# Altium schematic sheet USBtoRS232.SchDoc
size A4
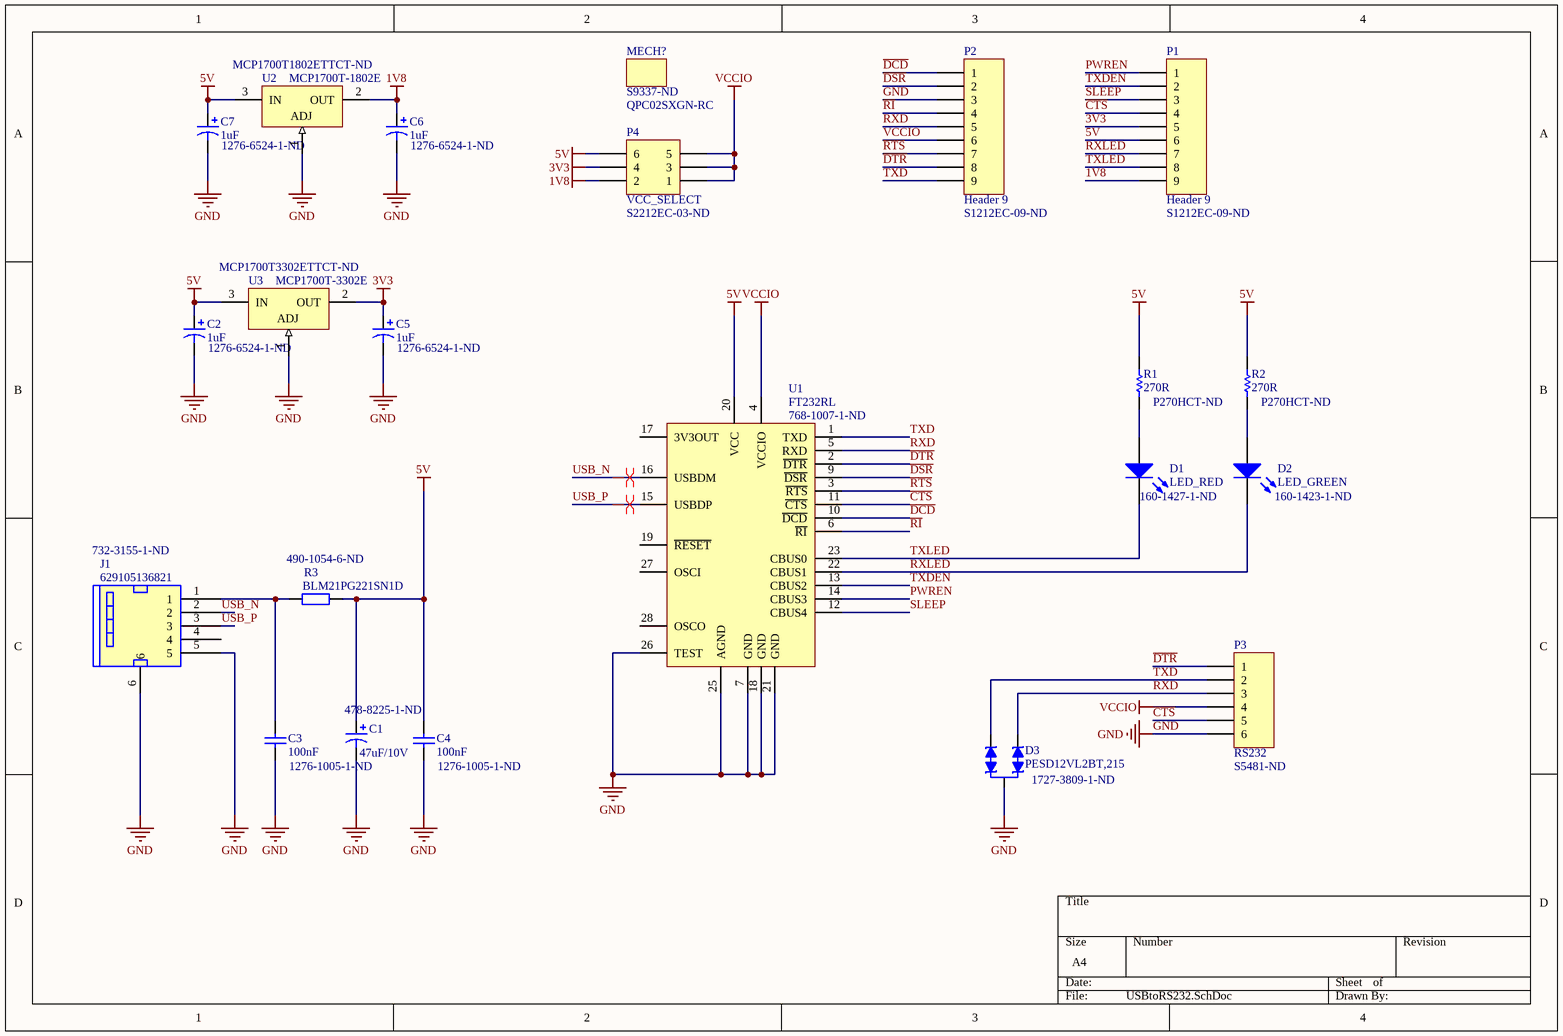
[diagram p0: USBtoRS232.SchDoc]

## Parts
C1  47uF/10V  Supplier Part Number 1: 478-8225-1-ND  [TANT_C1206(3216)]
C2  1uF  Supplier Part Number 1: 1276-6524-1-ND  [CAPC1608X09N]
C3  100nF  Supplier Part Number 1: 1276-1005-1-ND  [CAPC1608X09N]
C4  100nF  Supplier Part Number 1: 1276-1005-1-ND  [CAPC1608X09N]
C5  1uF  Supplier Part Number 1: 1276-6524-1-ND  [CAPC1608X09N]
C6  1uF  Supplier Part Number 1: 1276-6524-1-ND  [CAPC1608X09N]
C7  1uF  Supplier Part Number 1: 1276-6524-1-ND  [CAPC1608X09N]
D1  LED_RED  Supplier Part Number 1: 160-1427-1-ND  [L0805_RED]
D2  LED_GREEN  Supplier Part Number 1: 160-1423-1-ND  [L0805_GRE]
D3  PESD12VL2BT,215  Supplier Part Number 1: 1727-3809-1-ND  [SOT23-A]
J1  629105136821  Supplier Part Number 1: 732-3155-1-ND  [MICRO_USB]
MECH?  QPC02SXGN-RC  Supplier Part Number 1: S9337-ND
P1  Header 9  Supplier Part Number 1: S1212EC-09-ND  [Pin Header S/M 09x1 TH Pitch 2.54mm]
P2  Header 9  Supplier Part Number 1: S1212EC-09-ND  [Pin Header S/M 09x1 TH Pitch 2.54mm]
P3  RS232  Supplier Part Number 1: S5481-ND  [Pin Header RA/F 06x1 TH Pitch 2.54mm]
P4  VCC_SELECT  Supplier Part Number 1: S2212EC-03-ND  [Pin Header S/M 03x2 TH Pitch 2.54mm]
R1  270R  Supplier Part Number 1: P270HCT-ND  [RES1608X06N]
R2  270R  Supplier Part Number 1: P270HCT-ND  [RES1608X06N]
R3  BLM21PG221SN1D  Supplier Part Number 1: 490-1054-6-ND  [F0805(2012)]
U1  FT232RL  Supplier Part Number 1: 768-1007-1-ND  [SSOP-28]
U2  MCP1700T-1802E  Supplier Part Number 1: MCP1700T1802ETTCT-ND  [SOT23-A]
U3  MCP1700T-3302E  Supplier Part Number 1: MCP1700T3302ETTCT-ND  [SOT23-A]

## Nets
1V8: C6.1 P1.9 P4.2 U2.2(OUT)
3V3: C5.1 P1.5 P4.4 U3.2(OUT)
5V: C1.1 C2.1 C4.2 C7.1 P1.6 P4.6 R1.2 R2.2 R3.2 U1.20(VCC) U2.3(IN) U3.3(IN)
GND: C1.2 C2.2 C3.1 C4.1 C5.2 C6.2 C7.2 D3.3 J1.5 J1.6 P2.3 P3.6 U1.7(GND) U1.18(GND) U1.21(GND) U1.25(AGND) U1.26(TEST) U2.1(ADJ) U3.1(ADJ)
NC: U1.8(NC) U1.24(NC)
VCCIO: P2.6 P3.4 P4.1 P4.3 P4.5 U1.4(VCCIO)
~{CTS}: P1.4 P3.5 U1.11(~{CTS})
~{DCD}: P2.1 U1.10(~{DCD})
~{DSR}: P2.2 U1.9(~{DSR})
~{DTR}: P2.8 P3.1 U1.2(~{DTR})
PWREN: P1.1 U1.14(CBUS3)
~{RI}: P2.4 U1.6(~{RI})
~{RTS}: P2.7 U1.3(~{RTS})
RXD: D3.1 P2.5 P3.3 U1.5(RXD)
RXLED: D2.2(K) P1.7 U1.22(CBUS1)
SLEEP: P1.3 U1.12(CBUS4)
TXD: D3.2 P2.9 P3.2 U1.1(TXD)
TXDEN: P1.2 U1.13(CBUS2)
TXLED: D1.2(K) P1.8 U1.23(CBUS0)
USB_N: J1.2 U1.16(USBDM)
USB_P: J1.3 U1.15(USBDP)
NetC3_2: C3.2 J1.1 R3.1
NetD1_1: D1.1(A) R1.1
NetD2_1: D2.1(A) R2.1

Not connected (* = marked no-connect by the designer): J1 4; U1 17(3V3OUT) 19(~{RESET}) 27(OSCI) 28(OSCO)

## Layout directives
differential pair: USB_N, USB_P

## Library data of the parts
C1 = Cap Pol1: CAP TANT 47UF 20% 10V 1206; Manufacturer 1: AVX; Manufacturer Part Number 1: F931A476MAA; Supplier 1: Digi-Key; Stock 1: 29684; Pricing 1: 1=0,76000, 10=0,55900, 100=0,38340, 500=0,30350, 1000=0,25558 (USD); ComponentLink1URL: http://www.mouser.com/ds/2/40/f93-776559.pdf?src-supplier=Mouser; ComponentLink1Description: http://www.mouser.com/ds/2/40/f93-776559.pdf?src-supplier=Mouser; ComponentLink2URL: http://datasheets.avx.com/F93.pdf?src-supplier=Digi-Key; ComponentLink2Description: http://datasheets.avx.com/F93.pdf?src-supplier=Digi-Key; ComponentLink3URL: http://datasheet.octopart.com/F931A476MAA-AVX-datasheet-50868108.pdf?src-supplier=AVX; ComponentLink3Description: http://datasheet.octopart.com/F931A476MAA-AVX-datasheet-50868108.pdf?src-supplier=AVX; ComponentLink4URL: http://datasheet.octopart.com/F931A476MAA-AVX-datasheet-103254539.pdf?src-supplier=Newark; ComponentLink4Description: http://datasheet.octopart.com/F931A476MAA-AVX-datasheet-103254539.pdf?src-supplier=Newark
C2 C5-C7 = Cap Pol3: Ceramic Capacitor (Surface Mount); Manufacturer 1: Samsung; Manufacturer Part Number 1: CL10B105MO8NNWC; Voltage Rating: 16V; Tolerance: 20%; Supplier 1: Digi-Key; Stock 1: 10167463; Pricing 1: 1=0,10000, 10=0,04200, 100=0,01860, 500=0,01330, 1000=0,01045 (USD); Mount: Surface Mount; Case/Package: 0603; Case Code (Metric): 1608; Case Code (Imperial): 0603; Min Operating Temperature: -55°C; Max Operating Temperature: 125°C; Packaging: Tape and Reel; Capacitance: 1uF; Length: 0.063inch; Width: 0.031inch; Thickness: 0.035inch; ComponentLink1URL: http://www.samsungsem.com/kr/support/product-search/mlcc/CL10B105MO8NNWC.jsp?src-supplier=Digi-Key; ComponentLink1Description: http://www.samsungsem.com/kr/support/product-search/mlcc/CL10B105MO8NNWC.jsp?src-supplier=Digi-Key; ComponentLink2URL: http://datasheet.octopart.com/CL10B105MO8NNWC-Samsung-Electro-Mechanics-datasheet-68297032.pdf?src-supplier=Future+Electronics; ComponentLink2Description: http://datasheet.octopart.com/CL10B105MO8NNWC-Samsung-Electro-Mechanics-datasheet-68297032.pdf?src-supplier=Future+Electronics; ComponentLink3URL: http://datasheet.octopart.com/CL10B105MO8NNWC-Samsung-Electro-Mechanics-datasheet-96443611.pdf?src-supplier=Future+Electronics; ComponentLink3Description: http://datasheet.octopart.com/CL10B105MO8NNWC-Samsung-Electro-Mechanics-datasheet-96443611.pdf?src-supplier=Future+Electronics; ComponentLink4URL: http://datasheet.octopart.com/CL10B105MO8NNWC-Samsung-Electro-Mechanics-datasheet-120079234.pdf?src-supplier=Future+Electronics; ComponentLink4Description: http://datasheet.octopart.com/CL10B105MO8NNWC-Samsung-Electro-Mechanics-datasheet-120079234.pdf?src-supplier=Future+Electronics
C3 C4 = Cap: Ceramic Capacitor (Surface Mount); Manufacturer 1: Samsung; Manufacturer Part Number 1: CL10B104KO8NNNC; Tolerance: 10%; Voltage Rating: 16V; Dielectric: X7R; Supplier 1: Digi-Key; Stock 1: 12803497; Pricing 1: 1=0,10000, 10=0,02900, 100=0,01300, 500=0,00928, 1000=0,00729 (USD); Mount: Surface Mount; Case/Package: 0603; Case Code (Metric): 1608; Case Code (Imperial): 0603; Material: Ceramic; Contact Plating: Tin; Min Operating Temperature: -55°C; Max Operating Temperature: 125°C; Packaging: Tape and Reel; Capacitance: 100nF; Package Quantity: 1; Voltage: 16V; Voltage Rating (DC): 16V; Length: 1.6mm; Height: 0.8mm; Width: 0.031inch; Thickness: 0.035inch; Depth: 0.8mm; Radiation Hardening: No; Lead Free: Lead Free; ComponentLink1URL: https://datasheet.ciiva.com/26838/getdatasheetpartid-357417-26838418.pdf?src-supplier=Verical; ComponentLink1Description: https://datasheet.ciiva.com/26838/getdatasheetpartid-357417-26838418.pdf?src-supplier=Verical; ComponentLink2URL: https://datasheet.ciiva.com/25805/cl10b104ko8nnnc-25805483.pdf?src-supplier=Digi-Key; ComponentLink2Description: https://datasheet.ciiva.com/25805/cl10b104ko8nnnc-25805483.pdf?src-supplier=Digi-Key; ComponentLink3URL: https://datasheet.ciiva.com/29198/456679-da-01-en-vs-kondensator-0603-29198846.pdf?src-supplier=Conrad; ComponentLink3Description: https://datasheet.ciiva.com/29198/456679-da-01-en-vs-kondensator-0603-29198846.pdf?src-supplier=Conrad; ComponentLink4URL: http://datasheet.octopart.com/CL10B104KO8NNNC-Samsung-Electro-Mechanics-datasheet-8324245.pdf; ComponentLink4Description: http://datasheet.octopart.com/CL10B104KO8NNNC-Samsung-Electro-Mechanics-datasheet-8324245.pdf; ComponentLink5URL: http://datasheet.octopart.com/CL10B104KO8NNNC-Samsung-Electro-Mechanics-datasheet-11890603.pdf?src-supplier=Arrow; ComponentLink5Description: http://datasheet.octopart.com/CL10B104KO8NNNC-Samsung-Electro-Mechanics-datasheet-11890603.pdf?src-supplier=Arrow; ComponentLink6URL: http://datasheet.octopart.com/CL10B104KO8NNNC-Samsung-Electro-Mechanics-datasheet-81461844.pdf?src-supplier=Future+Electronics; ComponentLink6Description: http://datasheet.octopart.com/CL10B104KO8NNNC-Samsung-Electro-Mechanics-datasheet-81461844.pdf?src-supplier=Future+Electronics; ComponentLink7URL: http://datasheet.octopart.com/CL10B104KO8NNNC-Samsung-Electro-Mechanics-datasheet-116890973.pdf?src-supplier=Future+Electronics; ComponentLink7Description: http://datasheet.octopart.com/CL10B104KO8NNNC-Samsung-Electro-Mechanics-datasheet-116890973.pdf?src-supplier=Future+Electronics; ComponentLink8URL: http://datasheet.octopart.com/CL10B104KO8NNNC-Samsung-Electro-Mechanics-datasheet-136482305.pdf?src-supplier=Future+Electronics; ComponentLink8Description: http://datasheet.octopart.com/CL10B104KO8NNNC-Samsung-Electro-Mechanics-datasheet-136482305.pdf?src-supplier=Future+Electronics; ComponentLink9URL: http://datasheet.octopart.com/CL10B104KO8NNNC-Samsung-datasheet-8326407.pdf?src-supplier=TME; ComponentLink9Description: http://datasheet.octopart.com/CL10B104KO8NNNC-Samsung-datasheet-8326407.pdf?src-supplier=TME; ComponentLink10URL: http://datasheet.octopart.com/CL10B104KO8NNNC-Samsung-datasheet-26589157.pdf?src-supplier=Future+Electronics; ComponentLink10Description: http://datasheet.octopart.com/CL10B104KO8NNNC-Samsung-datasheet-26589157.pdf?src-supplier=Future+Electronics; ComponentLink11URL: http://datasheet.octopart.com/CL10B104KO8NNNC-Samsung-datasheet-42770384.pdf?src-supplier=Future+Electronics; ComponentLink11Description: http://datasheet.octopart.com/CL10B104KO8NNNC-Samsung-datasheet-42770384.pdf?src-supplier=Future+Electronics; ComponentLink12URL: http://datasheet.octopart.com/General-Multilayer-Ceramic-Capacitors-Samsung-datasheet-family-111.pdf; ComponentLink12Description: http://datasheet.octopart.com/General-Multilayer-Ceramic-Capacitors-Samsung-datasheet-family-111.pdf
D1 = LED0: LED RED CLEAR SMD; Manufacturer 1: Lite-On; Manufacturer Part Number 1: LTST-C171KRKT; Lens Color: Colorless; Viewing Angle: 130°; Lens Style: Diffused; Forward Current: 30mA; Forward Voltage: 2V; Power Rating: 75mW; Luminous Intensity: 54mcd; Test Current: 20mA; Dominant Wavelength: 631nm; Number of Elements: 1; Wavelength: 639nm; Reverse Voltage: 5V; Supplier 1: Digi-Key; Stock 1: 96925; Pricing 1: 1=0,29000, 10=0,21500, 100=0,10160, 500=0,06774, 1000=0,05306 (USD); Mount: Surface Mount; Case/Package: 0805; Number of Pins: 2; Color: Red; Case Code (Metric): 2012; Case Code (Imperial): 0805; Min Operating Temperature: -55°C; Max Operating Temperature: 85°C; Package Quantity: 3000; Packaging: Tape and Reel; Illumination Color: Red; Lens Transparency: Clear; Power Dissipation: 75mW; Number of LEDs: 1; Length: 2mm; Height: 0.8mm; Width: 1.25mm; Depth: 1.25mm; Radiation Hardening: No; Lead Free: Lead Free; ComponentLink1URL: https://datasheet.ciiva.com/12403/lite-on-ltst-c171krkt-187201-12403781.pdf?src-supplier=Mouser; ComponentLink1Description: https://datasheet.ciiva.com/12403/lite-on-ltst-c171krkt-187201-12403781.pdf?src-supplier=Mouser; ComponentLink2URL: https://datasheet.ciiva.com/11775/0900766b80dc0299-11775643.pdf?src-supplier=RSComponents; ComponentLink2Description: https://datasheet.ciiva.com/11775/0900766b80dc0299-11775643.pdf?src-supplier=RSComponents; ComponentLink3URL: https://datasheet.ciiva.com/16444/lite-on20ltst-c171krkt-16444779.pdf?src-supplier=Future+Electronics; ComponentLink3Description: https://datasheet.ciiva.com/16444/lite-on20ltst-c171krkt-16444779.pdf?src-supplier=Future+Electronics; ComponentLink4URL: https://datasheet.ciiva.com/2110/s-110-ltst-c171krkt-2110066.pdf?src-supplier=Digi-Key; ComponentLink4Description: https://datasheet.ciiva.com/2110/s-110-ltst-c171krkt-2110066.pdf?src-supplier=Digi-Key; ComponentLink5URL: https://datasheet.ciiva.com/2110/s-110-ltst-c171krkt-2110067.pdf?src-supplier=Digi-Key; ComponentLink5Description: https://datasheet.ciiva.com/2110/s-110-ltst-c171krkt-2110067.pdf?src-supplier=Digi-Key; ComponentLink6URL: https://datasheet.ciiva.com/2110/s-110-ltst-c171krkt-2110068.pdf?src-supplier=Digi-Key; ComponentLink6Description: https://datasheet.ciiva.com/2110/s-110-ltst-c171krkt-2110068.pdf?src-supplier=Digi-Key; ComponentLink7URL: http://datasheet.octopart.com/LTST-C171KRKT-Lite-On-datasheet-166436.pdf?src-supplier=_legacy+Avnet; ComponentLink7Description: http://datasheet.octopart.com/LTST-C171KRKT-Lite-On-datasheet-166436.pdf?src-supplier=_legacy+Avnet; ComponentLink8URL: http://datasheet.octopart.com/LTST-C171KRKT-Lite-On-datasheet-32046998.pdf?src-supplier=TME; ComponentLink8Description: http://datasheet.octopart.com/LTST-C171KRKT-Lite-On-datasheet-32046998.pdf?src-supplier=TME; ComponentLink9URL: http://datasheet.octopart.com/LTST-C171KRKT-Lite-On-datasheet-62737.pdf?src-supplier=Digi-Key; ComponentLink9Description: http://datasheet.octopart.com/LTST-C171KRKT-Lite-On-datasheet-62737.pdf?src-supplier=Digi-Key; ComponentLink10URL: http://datasheet.octopart.com/LTST-C171KRKT-Lite-On-datasheet-8330373.pdf?src-supplier=Future+Electronics; ComponentLink10Description: http://datasheet.octopart.com/LTST-C171KRKT-Lite-On-datasheet-8330373.pdf?src-supplier=Future+Electronics
D2 = LED0: LED GREEN CLEAR CHIP SMD; Manufacturer 1: Lite-On; Manufacturer Part Number 1: LTST-C171GKT; Lens Color: Colorless; Viewing Angle: 130°; Lens Style: Diffused; Luminous Intensity: 12mcd; Forward Current: 30mA; Forward Voltage: 2.1V; Power Rating: 100mW; Dominant Wavelength: 569nm; Test Current: 10mA; Number of Elements: 1; Wavelength: 585nm; Reverse Voltage: 5V; Supplier 1: Digi-Key; Stock 1: 194100; Pricing 1: 1=0,28000, 10=0,20100, 100=0,09540, 500=0,06364, 1000=0,04984 (USD); Mount: Surface Mount; Case/Package: 0805; Number of Pins: 2; Color: Green; Case Code (Metric): 2012; Case Code (Imperial): 0805; Min Operating Temperature: -55°C; Max Operating Temperature: 85°C; Package Quantity: 1; Packaging: Tape and Reel; Illumination Color: Green; Lens Transparency: Clear; Power Dissipation: 100mW; Number of LEDs: 1; Length: 2mm; Height: 0.8mm; Width: 1.25mm; Depth: 1.25mm; Radiation Hardening: No; Lead Free: Lead Free; ComponentLink1URL: https://datasheet.ciiva.com/11773/0900766b80dc0296-11773991.pdf?src-supplier=RSComponents; ComponentLink1Description: https://datasheet.ciiva.com/11773/0900766b80dc0296-11773991.pdf?src-supplier=RSComponents; ComponentLink2URL: https://datasheet.ciiva.com/2110/ltst-c171gkt-2110000.pdf?src-supplier=Digi-Key; ComponentLink2Description: https://datasheet.ciiva.com/2110/ltst-c171gkt-2110000.pdf?src-supplier=Digi-Key; ComponentLink3URL: https://datasheet.ciiva.com/12400/lite-on-ltst-c171gkt-190133-12400647.pdf?src-supplier=Mouser; ComponentLink3Description: https://datasheet.ciiva.com/12400/lite-on-ltst-c171gkt-190133-12400647.pdf?src-supplier=Mouser; ComponentLink4URL: https://datasheet.ciiva.com/2110/ltst-c171gkt-2110001.pdf?src-supplier=Digi-Key; ComponentLink4Description: https://datasheet.ciiva.com/2110/ltst-c171gkt-2110001.pdf?src-supplier=Digi-Key; ComponentLink5URL: https://datasheet.ciiva.com/2110/ltst-c171gkt-2110002.pdf?src-supplier=Digi-Key; ComponentLink5Description: https://datasheet.ciiva.com/2110/ltst-c171gkt-2110002.pdf?src-supplier=Digi-Key; ComponentLink6URL: https://datasheet.ciiva.com/16396/ltst-c171gkt-16396549.pdf?src-supplier=Future+Electronics; ComponentLink6Description: https://datasheet.ciiva.com/16396/ltst-c171gkt-16396549.pdf?src-supplier=Future+Electronics; ComponentLink7URL: http://datasheet.octopart.com/LTST-C171GKT-Lite-On-datasheet-95087.pdf?src-supplier=Future+Electronics; ComponentLink7Description: http://datasheet.octopart.com/LTST-C171GKT-Lite-On-datasheet-95087.pdf?src-supplier=Future+Electronics; ComponentLink8URL: http://datasheet.octopart.com/LTST-C171GKT-Lite-On-datasheet-158474.pdf?src-supplier=Arrow; ComponentLink8Description: http://datasheet.octopart.com/LTST-C171GKT-Lite-On-datasheet-158474.pdf?src-supplier=Arrow; ComponentLink9URL: http://datasheet.octopart.com/LTST-C171GKT-Lite-On-datasheet-7823512.pdf?src-supplier=Jameco; ComponentLink9Description: http://datasheet.octopart.com/LTST-C171GKT-Lite-On-datasheet-7823512.pdf?src-supplier=Jameco; ComponentLink10URL: http://datasheet.octopart.com/LTST-C171GKT-Lite-On-datasheet-62340966.pdf?src-supplier=TME; ComponentLink10Description: http://datasheet.octopart.com/LTST-C171GKT-Lite-On-datasheet-62340966.pdf?src-supplier=TME
D3 = PESD12VL2BT: TVS DIODE 12V 37V SOT23; Manufacturer 1: Nexperia; ComponentLink1URL: \\vikoonline\TPM-ARGE\AR-GE\DATA SHEET\; Supplier 1: Digi-Key; Manufacturer Part Number 1: PESD12VL2BT,215; Stock 1: 67274; Pricing 1: 1=0,48000, 10=0,38700, 100=0,26370, 500=0,19776, 1000=0,14832 (USD); ComponentLink2URL: http://www.farnell.com/datasheets/698115.pdf?src-supplier=Farnell; ComponentLink2Description: http://www.farnell.com/datasheets/698115.pdf?src-supplier=Farnell; ComponentLink3URL: https://assets.nexperia.com/documents/data-sheet/PESDXL2BT_SER.pdf?src-supplier=Digi-Key; ComponentLink3Description: https://assets.nexperia.com/documents/data-sheet/PESDXL2BT_SER.pdf?src-supplier=Digi-Key; ComponentLink4URL: http://www.farnell.com/datasheets/698115.pdf?src-supplier=Newark; ComponentLink4Description: http://www.farnell.com/datasheets/698115.pdf?src-supplier=Newark; ComponentLink5URL: http://datasheet.octopart.com/PESD12VL2BT%2C215-Nexperia-datasheet-78830454.pdf?src-supplier=Nexperia; ComponentLink5Description: http://datasheet.octopart.com/PESD12VL2BT%2C215-Nexperia-datasheet-78830454.pdf?src-supplier=Nexperia; ComponentLink6URL: http://datasheet.octopart.com/PESD12VL2BT%2C215-Nexperia-datasheet-10228526.pdf?src-supplier=Newark; ComponentLink6Description: http://datasheet.octopart.com/PESD12VL2BT%2C215-Nexperia-datasheet-10228526.pdf?src-supplier=Newark
J1 = MINI_USB: CONN RCPT USB2.0 MICRO B SMD R/A; Manufacturer 1: Würth Elektronik; Plating: Nickel; Current Rating: 1.8A; Gender: Receptacle; Voltage Rating: 30V; Connector Type: USB; Number of Contacts: 5; Insulation Resistance: 1GR; Number of Ports: 1; Supplier 1: Digi-Key; Manufacturer Part Number 1: 629105136821; Stock 1: 3452; Pricing 1: 1=1,29000, 10=1,27500, 50=1,18440, 100=1,09250, 500=1,00152 (USD); Mount: Surface Mount; Contact Plating: Gold; Contact Material: Copper Alloy; Color: Black; Min Operating Temperature: -40°C; Max Operating Temperature: 105°C; Package Quantity: 1400; Packaging: Tape and Reel; Number of Positions: 5; Termination: Solder; Orientation: Right Angle; USB Standard: USB 2.0; Length: 5.9mm; REACH SVHC: Unknown; Lead Free: Lead Free; Flammability Rating: UL94 V-0; ComponentLink1URL: https://datasheet.ciiva.com/851/629105136821-851196.pdf?src-supplier=Digi-Key; ComponentLink1Description: https://datasheet.ciiva.com/851/629105136821-851196.pdf?src-supplier=Digi-Key; ComponentLink2URL: https://datasheet.ciiva.com/12494/629105136821-221118-12494781.pdf?src-supplier=Mouser; ComponentLink2Description: https://datasheet.ciiva.com/12494/629105136821-221118-12494781.pdf?src-supplier=Mouser; ComponentLink3URL: https://datasheet.ciiva.com/851/629105136821-851197.pdf?src-supplier=Digi-Key; ComponentLink3Description: https://datasheet.ciiva.com/851/629105136821-851197.pdf?src-supplier=Digi-Key; ComponentLink4URL: https://datasheet.ciiva.com/851/629105136821-851198.pdf?src-supplier=Digi-Key; ComponentLink4Description: https://datasheet.ciiva.com/851/629105136821-851198.pdf?src-supplier=Digi-Key; ComponentLink5URL: http://datasheet.octopart.com/629105136821-W%C3%BCrth-Elektronik-datasheet-111088069.pdf?src-supplier=W%c3%bcrth+Elektronik; ComponentLink5Description: http://datasheet.octopart.com/629105136821-W%C3%BCrth-Elektronik-datasheet-111088069.pdf?src-supplier=W%c3%bcrth+Elektronik; ComponentLink6URL: http://datasheet.octopart.com/629105136821-W%C3%BCrth-Elektronik-datasheet-31669337.pdf?src-supplier=Future+Electronics; ComponentLink6Description: http://datasheet.octopart.com/629105136821-W%C3%BCrth-Elektronik-datasheet-31669337.pdf?src-supplier=Future+Electronics
MECH? = MECHANIC: CONN JUMPER SHORTING .100" GOLD; Manufacturer 1: Sullins; Number of Positions: 2; Pitch: 0.1inch; Supplier 1: Digi-Key; Manufacturer Part Number 1: QPC02SXGN-RC; Stock 1: 941348; Pricing 1: 1=0,10000, 10=0,05900, 25=0,04400, 50=0,03780, 100=0,03650, 250=0,03152, 500=0,03024, 1000=0,02646, 2500=0,02394 (USD); Case/Package: 100; Contact Plating: Gold; Package Quantity: 2000; Packaging: Bulk; Height: 0.235inch; Lead Free: Lead Free; ComponentLink1URL: https://datasheet.ciiva.com/767/284-sxgn-11510-767869.pdf?src-supplier=Digi-Key; ComponentLink1Description: https://datasheet.ciiva.com/767/284-sxgn-11510-767869.pdf?src-supplier=Digi-Key; ComponentLink2URL: http://datasheet.octopart.com/QPC02SXGN-RC-Sullins-datasheet-12521006.pdf?src-supplier=Future+Electronics; ComponentLink2Description: http://datasheet.octopart.com/QPC02SXGN-RC-Sullins-datasheet-12521006.pdf?src-supplier=Future+Electronics; ComponentLink3URL: http://datasheet.octopart.com/QPC02SXGN-RC-Sullins-datasheet-41399305.pdf?src-supplier=Future+Electronics; ComponentLink3Description: http://datasheet.octopart.com/QPC02SXGN-RC-Sullins-datasheet-41399305.pdf?src-supplier=Future+Electronics
P1 P2 = Header 9: CONN HEADER VERT 9POS 2.54MM; Manufacturer 1: Sullins; Manufacturer Part Number 1: PREC009SFAN-RC; Number of Positions: 9; Connector Type: Male Pin; Pitch: 0.1inch; Supplier 1: Digi-Key; Stock 1: 1652; Pricing 1: 1=0,24000, 10=0,22700, 25=0,19360, 50=0,16940, 100=0,15720, 250=0,13912, 500=0,13306 (USD); Mount: Through Hole; Color: Black; Contact Plating: Tin; Package Quantity: 1; Number of Rows: 1; Packaging: Bulk; Termination: Solder; Contact Mating Length: 0.318inch; ComponentLink1URL: https://datasheet.ciiva.com/740/xrxczzzsxxn-rc-st-11635-b-740956.pdf?src-supplier=Digi-Key; ComponentLink1Description: https://datasheet.ciiva.com/740/xrxczzzsxxn-rc-st-11635-b-740956.pdf?src-supplier=Digi-Key
P3 = Header 6H: CONN HDR 6POS 0.1 GOLD PCB R/A; Manufacturer 1: Sullins; Manufacturer Part Number 1: PPPC061LGBN-RC; Number of Positions: 6; Connector Type: Header; Pitch: 0.1inch; LatestRevisionDate: 17-Jul-2002; LatestRevisionNote: Re-released for DXP Platform.; Publisher: Altium Limited; Supplier 1: Digi-Key; Stock 1: 17616; Pricing 1: 1=0,66000, 10=0,58300, 100=0,50290, 500=0,41148, 1000=0,36576, 5000=0,33020 (USD); Mount: Through Hole; Color: Black; Contact Plating: Gold; Contact Material: Bronze; Housing Color: Black; Housing Material: Plastic; Package Quantity: 1000; Number of Rows: 1; Packaging: Bulk; Termination: Solder; Length: 15.7mm; Height: 2.4mm; Width: 8.5mm; Lead Free: Lead Free; ComponentLink1URL: https://media.digikey.com/pdf/Data%20Sheets/Sullins%20PDFs/Female_Headers.100_DS.pdf?src-supplier=Digi-Key; ComponentLink1Description: https://media.digikey.com/pdf/Data%20Sheets/Sullins%20PDFs/Female_Headers.100_DS.pdf?src-supplier=Digi-Key; ComponentLink2URL: http://www.sullinscorp.com/catalogs/78_Page80-81_HEADER_.100_2.54mm_FEMALE.pdf?src-supplier=Future+Electronics; ComponentLink2Description: http://www.sullinscorp.com/catalogs/78_Page80-81_HEADER_.100_2.54mm_FEMALE.pdf?src-supplier=Future+Electronics; ComponentLink3URL: http://datasheet.octopart.com/PPPC061LGBN-RC-Sullins-datasheet-11567.pdf?src-supplier=Digi-Key; ComponentLink3Description: http://datasheet.octopart.com/PPPC061LGBN-RC-Sullins-datasheet-11567.pdf?src-supplier=Digi-Key; ComponentLink4URL: http://datasheet.octopart.com/PPPC061LGBN-RC-Sullins-datasheet-12511165.pdf?src-supplier=Future+Electronics; ComponentLink4Description: http://datasheet.octopart.com/PPPC061LGBN-RC-Sullins-datasheet-12511165.pdf?src-supplier=Future+Electronics; ComponentLink5URL: http://datasheet.octopart.com/PPPC061LGBN-RC-Sullins-datasheet-41308905.pdf?src-supplier=Future+Electronics; ComponentLink5Description: http://datasheet.octopart.com/PPPC061LGBN-RC-Sullins-datasheet-41308905.pdf?src-supplier=Future+Electronics
P4 = Header 3X2A: CONN HEADER VERT 6POS 2.54MM; Manufacturer 1: Sullins; Manufacturer Part Number 1: PREC003DFAN-RC; Number of Positions: 6; Connector Type: Male Pin; Pitch: 0.1inch; Supplier 1: Digi-Key; Stock 1: 869; Pricing 1: 1=0,16000, 10=0,15100, 25=0,12920, 50=0,11280, 100=0,10480, 250=0,09272, 500=0,08870 (USD); RoHS: Yes; Mount: Through Hole; Color: Black; Contact Plating: Tin; Package Quantity: 1; Number of Rows: 2; Packaging: Bulk; Termination: Solder; Row Spacing: 0.1inch; Contact Mating Length: 0.318inch; ComponentLink1URL: https://datasheet.ciiva.com/741/xrxczzzdxxn-rc-11636-b-741002.pdf?src-supplier=Digi-Key; ComponentLink1Description: https://datasheet.ciiva.com/741/xrxczzzdxxn-rc-11636-b-741002.pdf?src-supplier=Digi-Key
R1 R2 = Res1: Resistor; Manufacturer 1: Panasonic; Manufacturer Part Number 1: ERJ-3EKF2700V; Power Rating: 100mW; Tolerance: 1%; Voltage Rating: 75V; Temperature Coefficient: 100ppm/°C; Supplier 1: Digi-Key; Stock 1: 340311; Pricing 1: 1=0,10000, 10=0,06500, 100=0,02640, 1000=0,01186, 2500=0,01029 (USD); Mount: Surface Mount; Case/Package: 0603; Number of Pins: 2; Case Code (Imperial): 0603; Case Code (Metric): 1608; Contact Plating: Tin; Min Operating Temperature: -55°C; Max Operating Temperature: 155°C; Resistance: 270R; Packaging: Tape and Reel; Package Quantity: 1; Composition: Thick Film; Number of Terminations: 2; Military Standard: Not; Termination: SMD/SMT; Max Power Dissipation: 100mW; Voltage Rating (DC): 75V; Features: Automotive AEC-Q200; Length: 1.6mm; Height: 0.022inch; Width: 0.8mm; Depth: 0.8mm; Radiation Hardening: No; REACH SVHC: No SVHC; Lead Free: Lead Free; ComponentLink1URL: https://datasheet.ciiva.com/5860/aoa0000ce2-5860661.pdf?src-supplier=Farnell; ComponentLink1Description: https://datasheet.ciiva.com/5860/aoa0000ce2-5860661.pdf?src-supplier=Farnell; ComponentLink2URL: https://datasheet.ciiva.com/9183/aoa0000ce2-9183606.pdf?src-supplier=Avnet; ComponentLink2Description: https://datasheet.ciiva.com/9183/aoa0000ce2-9183606.pdf?src-supplier=Avnet; ComponentLink3URL: https://datasheet.ciiva.com/16776/70260748-16776089.pdf?src-supplier=Allied+Electronics; ComponentLink3Description: https://datasheet.ciiva.com/16776/70260748-16776089.pdf?src-supplier=Allied+Electronics; ComponentLink4URL: https://datasheet.ciiva.com/17206/aoa0000ce2-17206490.pdf?src-supplier=Avnet+Europe; ComponentLink4Description: https://datasheet.ciiva.com/17206/aoa0000ce2-17206490.pdf?src-supplier=Avnet+Europe; ComponentLink5URL: http://datasheet.octopart.com/ERJ-3EKF2700V-Panasonic-datasheet-13266541.pdf?src-supplier=Farnell; ComponentLink5Description: http://datasheet.octopart.com/ERJ-3EKF2700V-Panasonic-datasheet-13266541.pdf?src-supplier=Farnell; ComponentLink6URL: http://datasheet.octopart.com/ERJ-3EKF2700V-Panasonic-datasheet-5313456.pdf?src-supplier=Element14; ComponentLink6Description: http://datasheet.octopart.com/ERJ-3EKF2700V-Panasonic-datasheet-5313456.pdf?src-supplier=Element14; ComponentLink7URL: http://datasheet.octopart.com/ERJ-3EKF2700V-Panasonic-datasheet-8853621.pdf?src-supplier=Element14; ComponentLink7Description: http://datasheet.octopart.com/ERJ-3EKF2700V-Panasonic-datasheet-8853621.pdf?src-supplier=Element14; ComponentLink8URL: http://datasheet.octopart.com/ERJ-3EKF2700V-Panasonic-datasheet-10025800.pdf?src-supplier=Element14; ComponentLink8Description: http://datasheet.octopart.com/ERJ-3EKF2700V-Panasonic-datasheet-10025800.pdf?src-supplier=Element14; ComponentLink9URL: http://datasheet.octopart.com/ERJ-3EKF2700V-Panasonic-datasheet-48891056.pdf?src-supplier=Newark; ComponentLink9Description: http://datasheet.octopart.com/ERJ-3EKF2700V-Panasonic-datasheet-48891056.pdf?src-supplier=Newark; ComponentLink10URL: http://datasheet.octopart.com/ERJ-3EKF2700V-Panasonic-datasheet-41391857.pdf?src-supplier=Electro+Sonic; ComponentLink10Description: http://datasheet.octopart.com/ERJ-3EKF2700V-Panasonic-datasheet-41391857.pdf?src-supplier=Electro+Sonic; ComponentLink11URL: http://datasheet.octopart.com/ERJ-3EKF2700V-Panasonic-datasheet-78375410.pdf; ComponentLink11Description: http://datasheet.octopart.com/ERJ-3EKF2700V-Panasonic-datasheet-78375410.pdf; ComponentLink12URL: http://datasheet.octopart.com/ERJ-3EKF2700V-Panasonic-datasheet-82288794.pdf?src-supplier=Future+Electronics; ComponentLink12Description: http://datasheet.octopart.com/ERJ-3EKF2700V-Panasonic-datasheet-82288794.pdf?src-supplier=Future+Electronics; ComponentLink13URL: http://datasheet.octopart.com/ERJ3EKF2700V-Panasonic-datasheet-11542829.pdf?src-supplier=Arrow; ComponentLink13Description: http://datasheet.octopart.com/ERJ3EKF2700V-Panasonic-datasheet-11542829.pdf?src-supplier=Arrow
R3 = Res2: FERRITE BEAD 220 OHM 0805 1LN; Manufacturer 1: Murata; Impedance: 220R; Tolerance: 25%; Max Current Rating: 2A; Number of Lines: 1; DC Resistance (DCR): 45mR; Test Frequency: 100MHz; Shielding: Unshielded; Supplier 1: Digi-Key; Manufacturer Part Number 1: BLM21PG221SN1D; Stock 1: 307959; Pricing 1: 1=0,10000, 10=0,08100, 25=0,07320, 50=0,05380, 100=0,04640, 250=0,03664, 500=0,03094, 1000=0,02605 (USD); Case/Package: 0805; Number of Pins: 2; Core Material: Ferrite; Case Code (Metric): 2012; Case Code (Imperial): 0805; Material: Ferrite; Contact Plating: Tin; Min Operating Temperature: -55°C; Max Operating Temperature: 125°C; Package Quantity: 1; Packaging: Tape and Reel; Current Rating: 2A; Max DC Current: 2A; Termination: SMD/SMT; DC Current: 2A; Military Standard: Not; Frequency: 100MHz; Number of Circuits: 1; Current: 2A; Length: 2mm; Height: 0.85mm; Width: 1.25mm; Depth: 1.25mm; Radiation Hardening: No; REACH SVHC: No SVHC; Lead Free: Lead Free; ComponentLink1URL: https://datasheet.ciiva.com/1012/l0110s0100blm21p-1012288.pdf?src-supplier=Digi-Key; ComponentLink1Description: https://datasheet.ciiva.com/1012/l0110s0100blm21p-1012288.pdf?src-supplier=Digi-Key; ComponentLink2URL: https://datasheet.ciiva.com/11799/0900766b81275e31-11799232.pdf?src-supplier=RSComponents; ComponentLink2Description: https://datasheet.ciiva.com/11799/0900766b81275e31-11799232.pdf?src-supplier=RSComponents; ComponentLink3URL: https://datasheet.ciiva.com/30514/1845321-30514028.pdf?src-supplier=Jameco; ComponentLink3Description: https://datasheet.ciiva.com/30514/1845321-30514028.pdf?src-supplier=Jameco; ComponentLink4URL: https://datasheet.ciiva.com/29348/442529-da-01-en-chip-drossel-0805-220r-2000ma-2-0x1-25mm-29348007.pdf?src-supplier=Conrad; ComponentLink4Description: https://datasheet.ciiva.com/29348/442529-da-01-en-chip-drossel-0805-220r-2000ma-2-0x1-25mm-29348007.pdf?src-supplier=Conrad; ComponentLink5URL: https://datasheet.ciiva.com/1012/l0110s0100blm21p-1012289.pdf?src-supplier=Digi-Key; ComponentLink5Description: https://datasheet.ciiva.com/1012/l0110s0100blm21p-1012289.pdf?src-supplier=Digi-Key; ComponentLink6URL: https://datasheet.ciiva.com/14122/anblm21p-data-e-14122214.pdf?src-supplier=Distrelec; ComponentLink6Description: https://datasheet.ciiva.com/14122/anblm21p-data-e-14122214.pdf?src-supplier=Distrelec; ComponentLink7URL: https://datasheet.ciiva.com/3081/l0110s0100blm21p-3081655.pdf?src-supplier=Avnet; ComponentLink7Description: https://datasheet.ciiva.com/3081/l0110s0100blm21p-3081655.pdf?src-supplier=Avnet; ComponentLink8URL: https://datasheet.ciiva.com/16215/l0110s0100blm21p-16215194.pdf?src-supplier=Future+Electronics; ComponentLink8Description: https://datasheet.ciiva.com/16215/l0110s0100blm21p-16215194.pdf?src-supplier=Future+Electronics; ComponentLink9URL: https://datasheet.ciiva.com/8021/1756152-8021596.pdf?src-supplier=Element14; ComponentLink9Description: https://datasheet.ciiva.com/8021/1756152-8021596.pdf?src-supplier=Element14; ComponentLink10URL: http://datasheet.octopart.com/BLM21PG221SN1D-Murata-datasheet-135086726.pdf?src-supplier=TME; ComponentLink10Description: http://datasheet.octopart.com/BLM21PG221SN1D-Murata-datasheet-135086726.pdf?src-supplier=TME; ComponentLink11URL: http://datasheet.octopart.com/BLM21PG221SN1D-Murata-datasheet-11743916.pdf?src-supplier=Element14; ComponentLink11Description: http://datasheet.octopart.com/BLM21PG221SN1D-Murata-datasheet-11743916.pdf?src-supplier=Element14; ComponentLink12URL: http://datasheet.octopart.com/BLM21PG221SN1D-Murata-datasheet-53019.pdf?src-supplier=TME; ComponentLink12Description: http://datasheet.octopart.com/BLM21PG221SN1D-Murata-datasheet-53019.pdf?src-supplier=TME; ComponentLink13URL: http://datasheet.octopart.com/BLM21PG221SN1D-Murata-datasheet-37129980.pdf; ComponentLink13Description: http://datasheet.octopart.com/BLM21PG221SN1D-Murata-datasheet-37129980.pdf; ComponentLink14URL: http://datasheet.octopart.com/BLM21PG221SN1D-Murata-datasheet-554271.pdf?src-supplier=_legacy+Avnet; ComponentLink14Description: http://datasheet.octopart.com/BLM21PG221SN1D-Murata-datasheet-554271.pdf?src-supplier=_legacy+Avnet; ComponentLink15URL: http://datasheet.octopart.com/BLM21PG221SN1D-Murata-datasheet-8359900.pdf?src-supplier=_legacy+Avnet; ComponentLink15Description: http://datasheet.octopart.com/BLM21PG221SN1D-Murata-datasheet-8359900.pdf?src-supplier=_legacy+Avnet; ComponentLink16URL: http://datasheet.octopart.com/BLM21PG221SN1D-Murata-datasheet-153769.pdf?src-supplier=Mouser; ComponentLink16Description: http://datasheet.octopart.com/BLM21PG221SN1D-Murata-datasheet-153769.pdf?src-supplier=Mouser; ComponentLink17URL: http://datasheet.octopart.com/BLM21PG221SN1D-Murata-datasheet-8197962.pdf?src-supplier=Jameco; ComponentLink17Description: http://datasheet.octopart.com/BLM21PG221SN1D-Murata-datasheet-8197962.pdf?src-supplier=Jameco; ComponentLink18URL: http://datasheet.octopart.com/BLM21PG221SN1D-Murata-datasheet-14066484.pdf?src-supplier=IIIC; ComponentLink18Description: http://datasheet.octopart.com/BLM21PG221SN1D-Murata-datasheet-14066484.pdf?src-supplier=IIIC; ComponentLink19URL: http://datasheet.octopart.com/BLM21PG221SN1D-Murata-datasheet-8508678.pdf?src-supplier=Newark; ComponentLink19Description: http://datasheet.octopart.com/BLM21PG221SN1D-Murata-datasheet-8508678.pdf?src-supplier=Newark; ComponentLink20URL: http://datasheet.octopart.com/BLM21PG221SN1D-Murata-datasheet-10083551.pdf?src-supplier=Newark; ComponentLink20Description: http://datasheet.octopart.com/BLM21PG221SN1D-Murata-datasheet-10083551.pdf?src-supplier=Newark; ComponentLink21URL: http://datasheet.octopart.com/BLM21PG221SN1D-Murata-datasheet-12522583.pdf?src-supplier=Newark; ComponentLink21Description: http://datasheet.octopart.com/BLM21PG221SN1D-Murata-datasheet-12522583.pdf?src-supplier=Newark; ComponentLink22URL: http://datasheet.octopart.com/BLM21PG221SN1D-Murata-datasheet-62086381.pdf?src-supplier=Future+Electronics; ComponentLink22Description: http://datasheet.octopart.com/BLM21PG221SN1D-Murata-datasheet-62086381.pdf?src-supplier=Future+Electronics
U1 = IC_FT232RL: FT232R USB UART; Manufacturer 1: FTDI; Manufacturer Part Number 1: FT232RL-REEL; Interface: UART,RS-232,RS-422,RS-485; Number of Channels: 1; Max Supply Voltage: 5.25V; Min Supply Voltage: 3.3V; Data Rate: 12Mbps; Operating Supply Current: 15mA; Voltage: 5V; Supplier 1: Digi-Key; Stock 1: 69457; Pricing 1: 1=4,50000, 10=4,05000, 50=3,85000, 100=3,65000, 250=3,25000, 500=2,85002, 1000=2,65000 (USD); RoHS: Yes; Mount: Surface Mount; Case/Package: SSOP; Number of Pins: 28; Weight: 0.080001oz; Min Operating Temperature: -40°C; Max Operating Temperature: 85°C; Packaging: Tape and Reel; Package Quantity: 2000; Number of Transceivers: 1; Length: 10.2mm; Height: 1.75mm; Width: 5.3mm; Radiation Hardening: No; REACH SVHC: No SVHC; Lead Free: Lead Free; ComponentLink1URL: https://datasheet.ciiva.com/34304/2161019-34304054.pdf?src-supplier=Jameco; ComponentLink1Description: https://datasheet.ciiva.com/34304/2161019-34304054.pdf?src-supplier=Jameco; ComponentLink2URL: https://datasheet.ciiva.com/4787/ds-ft232r-11534-4787658.pdf?src-supplier=Mouser; ComponentLink2Description: https://datasheet.ciiva.com/4787/ds-ft232r-11534-4787658.pdf?src-supplier=Mouser; ComponentLink3URL: https://datasheet.ciiva.com/26841/ft232rl-reel-26841080.pdf?src-supplier=IIIC; ComponentLink3Description: https://datasheet.ciiva.com/26841/ft232rl-reel-26841080.pdf?src-supplier=IIIC; ComponentLink4URL: https://datasheet.ciiva.com/1787/ds-ft232r-1787047.pdf?src-supplier=Digi-Key; ComponentLink4Description: https://datasheet.ciiva.com/1787/ds-ft232r-1787047.pdf?src-supplier=Digi-Key; ComponentLink5URL: https://datasheet.ciiva.com/1787/ds-ft232r-1787048.pdf?src-supplier=Digi-Key; ComponentLink5Description: https://datasheet.ciiva.com/1787/ds-ft232r-1787048.pdf?src-supplier=Digi-Key; ComponentLink6URL: https://datasheet.ciiva.com/1787/ds-ft232r-1787049.pdf?src-supplier=Digi-Key; ComponentLink6Description: https://datasheet.ciiva.com/1787/ds-ft232r-1787049.pdf?src-supplier=Digi-Key; ComponentLink7URL: https://datasheet.ciiva.com/15150/getdatasheetpartid-643207-15150506.pdf?src-supplier=Verical; ComponentLink7Description: https://datasheet.ciiva.com/15150/getdatasheetpartid-643207-15150506.pdf?src-supplier=Verical; ComponentLink8URL: https://datasheet.ciiva.com/16200/ds-ft232r-16200652.pdf?src-supplier=Future+Electronics; ComponentLink8Description: https://datasheet.ciiva.com/16200/ds-ft232r-16200652.pdf?src-supplier=Future+Electronics
U2 = LM337H: Three-Terminal Adjustable Negative Voltage Regulator; Manufacturer 1: Microchip; Manufacturer Part Number 1: MCP1700T-1802E/TT; Min Input Voltage: 2.3V; Max Input Voltage: 6V; Output Current: 250mA; Dropout Voltage: 150mV; Number of Outputs: 1; Output Voltage: 1.8V; Quiescent Current: 4uA; Polarity: Positive; Output Type: Fixed; Max Power Dissipation: 369.6mW; Input Bias Current: 1.6uA; Accuracy: 2%; ComponentLink1Description: Manufacturer Link; ComponentLink1URL: http://www.st.com/; ComponentLink2Description: Datasheet; ComponentLink2URL: http://www.st.com/stonline/products/literature/ds/2167/lm137.pdf; Supplier 1: Digi-Key; Stock 1: 25812; Pricing 1: 1=0,38000, 25=0,31920, 100=0,28840 (USD); RoHS: Yes; Mount: Surface Mount; Case/Package: SOT-23; Number of Pins: 3; Min Operating Temperature: -40°C; Max Operating Temperature: 125°C; Packaging: Tape and Reel; Max Output Current: 250mA; Package Quantity: 3000; Min Output Voltage: 1.8V; Output Voltage Accuracy: 2%; Nominal Supply Current: 4uA; Nominal Output Voltage: 1.8V; Power Dissipation: 369.6mW; Max Supply Voltage: 6V; Min Supply Voltage: 2.3V; Max Output Voltage: 1.8V; Termination: SMD/SMT; Length: 2.9mm; Height: 0.95mm; Width: 1.3mm; Radiation Hardening: No; Lead Free: Lead Free; REACH SVHC: No SVHC; ComponentLink3URL: https://datasheet.ciiva.com/14150/mcp1700-eng-tds-14150117.pdf?src-supplier=Distrelec; ComponentLink3Description: https://datasheet.ciiva.com/14150/mcp1700-eng-tds-14150117.pdf?src-supplier=Distrelec; ComponentLink4URL: https://datasheet.ciiva.com/17364/jp011779-17364282.pdf?src-supplier=Avnet+Europe; ComponentLink4Description: https://datasheet.ciiva.com/17364/jp011779-17364282.pdf?src-supplier=Avnet+Europe; ComponentLink5URL: https://datasheet.ciiva.com/2040/21826b-2040109.pdf?src-supplier=Digi-Key; ComponentLink5Description: https://datasheet.ciiva.com/2040/21826b-2040109.pdf?src-supplier=Digi-Key; ComponentLink6URL: https://datasheet.ciiva.com/8041/21826b-8041597.pdf?src-supplier=Element14; ComponentLink6Description: https://datasheet.ciiva.com/8041/21826b-8041597.pdf?src-supplier=Element14; ComponentLink7URL: https://datasheet.ciiva.com/2040/21826b-2040110.pdf?src-supplier=Digi-Key; ComponentLink7Description: https://datasheet.ciiva.com/2040/21826b-2040110.pdf?src-supplier=Digi-Key; ComponentLink8URL: https://datasheet.ciiva.com/8237/jp011779-8237326.pdf?src-supplier=Avnet; ComponentLink8Description: https://datasheet.ciiva.com/8237/jp011779-8237326.pdf?src-supplier=Avnet; ComponentLink9URL: https://datasheet.ciiva.com/16218/filehandler-aspxddocname-en011779-16218350.pdf?src-supplier=Future+Electronics; ComponentLink9Description: https://datasheet.ciiva.com/16218/filehandler-aspxddocname-en011779-16218350.pdf?src-supplier=Future+Electronics; ComponentLink10URL: https://datasheet.ciiva.com/2040/21826b-2040111.pdf?src-supplier=Digi-Key; ComponentLink10Description: https://datasheet.ciiva.com/2040/21826b-2040111.pdf?src-supplier=Digi-Key; ComponentLink11URL: https://datasheet.ciiva.com/7649/21826b-7649807.pdf?src-supplier=Element14; ComponentLink11Description: https://datasheet.ciiva.com/7649/21826b-7649807.pdf?src-supplier=Element14
U3 = LM337H: Three-Terminal Adjustable Negative Voltage Regulator; Manufacturer 1: Microchip; Manufacturer Part Number 1: MCP1700T-3302E/TT; Number of Outputs: 1; Min Input Voltage: 2.3V; Max Input Voltage: 6V; Output Voltage: 3.3V; Dropout Voltage: 178mV; Output Current: 250mA; Polarity: Positive; Quiescent Current: 4uA; Output Type: Fixed; Max Power Dissipation: 369.6mW; Input Bias Current: 1.6uA; Accuracy: 2%; ComponentLink1Description: Manufacturer Link; ComponentLink1URL: http://www.st.com/; ComponentLink2Description: Datasheet; ComponentLink2URL: http://www.st.com/stonline/products/literature/ds/2167/lm137.pdf; Supplier 1: Digi-Key; Stock 1: 100934; Pricing 1: 1=0,38000, 25=0,31920, 100=0,28840 (USD); RoHS: Yes; Mount: Surface Mount; Case/Package: SOT-23; Number of Pins: 3; Contact Plating: Tin,Matte; Min Operating Temperature: -40°C; Max Operating Temperature: 125°C; Packaging: Tape and Reel; Max Output Current: 250mA; Package Quantity: 3000; Nominal Output Voltage: 3.3V; Max Supply Voltage: 6V; Min Supply Voltage: 2.3V; Min Output Voltage: 3.3V; Max Output Voltage: 3.3V; Termination: SMD/SMT; Output Voltage Accuracy: 2%; Nominal Supply Current: 4uA; Power Dissipation: 369.6mW; Length: 2.9mm; Height: 0.95mm; Width: 1.3mm; Radiation Hardening: No; REACH SVHC: No SVHC; Lead Free: Lead Free; ComponentLink3URL: https://datasheet.ciiva.com/2040/21826b-2040112.pdf?src-supplier=Digi-Key; ComponentLink3Description: https://datasheet.ciiva.com/2040/21826b-2040112.pdf?src-supplier=Digi-Key; ComponentLink4URL: https://datasheet.ciiva.com/5801/1784514-5801824.pdf?src-supplier=Farnell; ComponentLink4Description: https://datasheet.ciiva.com/5801/1784514-5801824.pdf?src-supplier=Farnell; ComponentLink5URL: https://datasheet.ciiva.com/2040/21826b-2040114.pdf?src-supplier=Digi-Key; ComponentLink5Description: https://datasheet.ciiva.com/2040/21826b-2040114.pdf?src-supplier=Digi-Key; ComponentLink6URL: https://datasheet.ciiva.com/7649/1784514-7649813.pdf?src-supplier=Element14; ComponentLink6Description: https://datasheet.ciiva.com/7649/1784514-7649813.pdf?src-supplier=Element14; ComponentLink7URL: https://datasheet.ciiva.com/17364/jp011779-17364263.pdf?src-supplier=Avnet+Europe; ComponentLink7Description: https://datasheet.ciiva.com/17364/jp011779-17364263.pdf?src-supplier=Avnet+Europe; ComponentLink8URL: https://datasheet.ciiva.com/14150/mcp1700-eng-tds-14150122.pdf?src-supplier=Distrelec; ComponentLink8Description: https://datasheet.ciiva.com/14150/mcp1700-eng-tds-14150122.pdf?src-supplier=Distrelec; ComponentLink9URL: https://datasheet.ciiva.com/8041/1784514-8041598.pdf?src-supplier=Element14; ComponentLink9Description: https://datasheet.ciiva.com/8041/1784514-8041598.pdf?src-supplier=Element14; ComponentLink10URL: https://datasheet.ciiva.com/2040/21826b-2040113.pdf?src-supplier=Digi-Key; ComponentLink10Description: https://datasheet.ciiva.com/2040/21826b-2040113.pdf?src-supplier=Digi-Key; ComponentLink11URL: https://datasheet.ciiva.com/3224/jp011779-3224133.pdf?src-supplier=Avnet; ComponentLink11Description: https://datasheet.ciiva.com/3224/jp011779-3224133.pdf?src-supplier=Avnet; ComponentLink12URL: https://datasheet.ciiva.com/15200/getdatasheetpartid-453599-15200229.pdf?src-supplier=Verical; ComponentLink12Description: https://datasheet.ciiva.com/15200/getdatasheetpartid-453599-15200229.pdf?src-supplier=Verical; ComponentLink13URL: https://datasheet.ciiva.com/22710/1784514-22710988.pdf?src-supplier=Element14; ComponentLink13Description: https://datasheet.ciiva.com/22710/1784514-22710988.pdf?src-supplier=Element14; ComponentLink14URL: https://datasheet.ciiva.com/16208/filehandler-aspxddocname-en011779-16208911.pdf?src-supplier=Future+Electronics; ComponentLink14Description: https://datasheet.ciiva.com/16208/filehandler-aspxddocname-en011779-16208911.pdf?src-supplier=Future+Electronics; ComponentLink15URL: https://datasheet.ciiva.com/29305/651414-da-01-en-ic-reg-ld-mcp1700t-3302e-tt-sot-23-3-mcp-29305258.pdf?src-supplier=Conrad; ComponentLink15Description: https://datasheet.ciiva.com/29305/651414-da-01-en-ic-reg-ld-mcp1700t-3302e-tt-sot-23-3-mcp-29305258.pdf?src-supplier=Conrad